# Altium schematic sheet TPA_LR.SchDoc
size A4; SheetNumber: 4; SheetTotal: 8
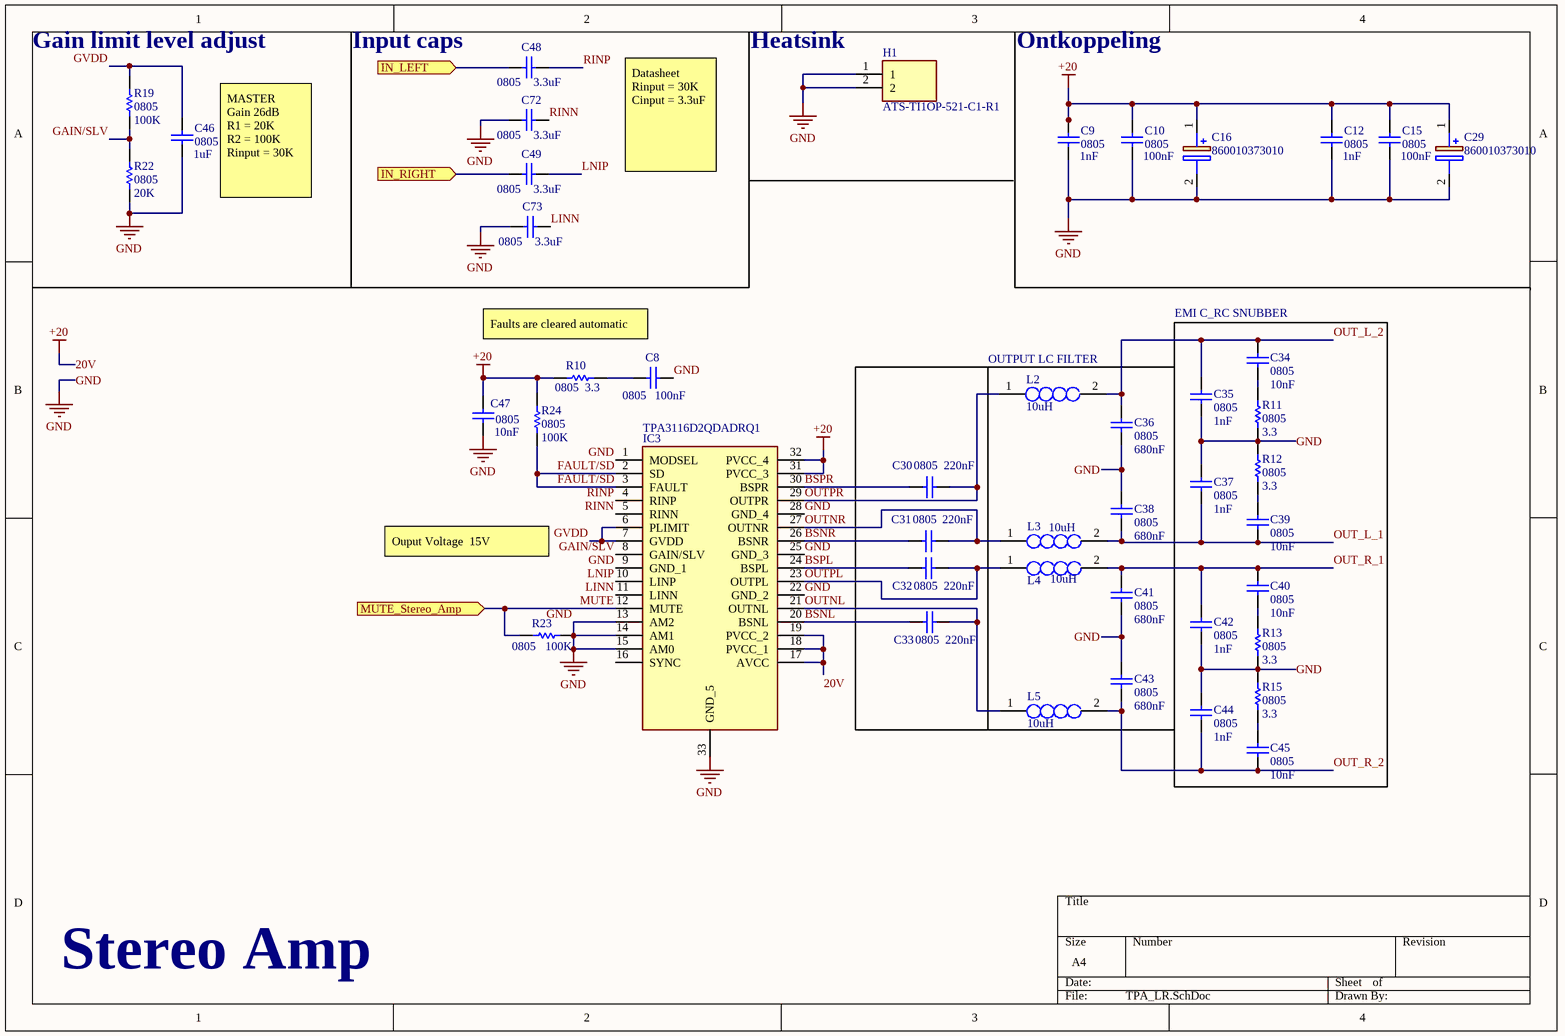
[diagram p0: TPA_LR.SchDoc]

## Parts
C8  0805  value 100nF  [6-0805_N]
C9  0805  value 1nF  [6-0805_N]
C10  0805  value 100nF  [6-0805_N]
C12  0805  value 1nF  [6-0805_N]
C15  0805  value 100nF  [6-0805_N]
C16  860010373010  [CAPPRD250W52D630H1250]
C29  860010373010  [CAPPRD250W52D630H1250]
C30  0805  value 220nF  [6-0805_N]
C31  0805  value 220nF  [6-0805_N]
C32  0805  value 220nF  [6-0805_N]
C33  0805  value 220nF  [6-0805_N]
C34  0805  value 10nF  [6-0805_N]
C35  0805  value 1nF  [6-0805_N]
C36  0805  value 680nF  [6-0805_N]
C37  0805  value 1nF  [6-0805_N]
C38  0805  value 680nF  [6-0805_N]
C39  0805  value 10nF  [6-0805_N]
C40  0805  value 10nF  [6-0805_N]
C41  0805  value 680nF  [6-0805_N]
C42  0805  value 1nF  [6-0805_N]
C43  0805  value 680nF  [6-0805_N]
C44  0805  value 1nF  [6-0805_N]
C45  0805  value 10nF  [6-0805_N]
C46  0805  value 1uF  [6-0805_N]
C47  0805  value 10nF  [6-0805_N]
C48  0805  value 3.3uF  [6-0805_N]
C49  0805  value 3.3uF  [6-0805_N]
C72  0805  value 3.3uF  [6-0805_N]
C73  0805  value 3.3uF  [6-0805_N]
H1  ATS-TI1OP-521-C1-R1  [ATSTI1OP521C1R1]
IC3  TPA3116D2QDADRQ1  [SOP65P810X120-33N]
L2  10uH  [INDPM110100X400N]
L3  10uH  [INDPM110100X400N]
L4  10uH  [INDPM110100X400N]
L5  10uH  [INDPM110100X400N]
R10  0805  value 3.3  [6-0805_N]
R11  0805  value 3.3  [6-0805_N]
R12  0805  value 3.3  [6-0805_N]
R13  0805  value 3.3  [6-0805_N]
R15  0805  value 3.3  [6-0805_N]
R19  0805  value 100K  [6-0805_N]
R22  0805  value 20K  [6-0805_N]
R23  0805  value 100K  [6-0805_N]
R24  0805  value 100K  [6-0805_N]

## Blocks framed on the sheet
EMI C_RC SNUBBER: C34 C35 C37 C39 C40 C42 C44 C45 R11-R13 R15
OUTPUT LC FILTER: C30-C33

## Ports
IN_LEFT (in, see Main[3A]), IN_RIGHT (in, see Main[3A]), MUTE_Stereo_Amp (in, see Main[3B], AnalogSwitch[3B])

## Nets
20V: C9.1 C10.1 C12.1 C15.1 C16.1(+) C29.1(+) C47.1 IC3.17(AVCC) IC3.18(PVCC_1) IC3.19(PVCC_2) IC3.31(PVCC_3) IC3.32(PVCC_4) R10.2 R24.2  [also labelled +20]
GND: C8.2 C9.2 C10.2 C12.2 C15.2 C16.2(-) C29.2(-) C35.1 C36.1 C37.2 C38.2 C41.1 C42.1 C43.2 C44.2 C46.2 C47.2 C72.1 C73.1 H1.1 H1.2 IC3.1(MODSEL) IC3.9(GND_1) IC3.13(AM2) IC3.14(AM1) IC3.15(AM0) IC3.22(GND_2) IC3.25(GND_3) IC3.28(GND_4) IC3.33(GND_5) R11.1 R12.2 R13.1 R15.2 R22.1 R23.1
BSNL: C33.1 IC3.20(BSNL)
BSNR: C31.1 IC3.26(BSNR)
BSPL: C32.1 IC3.24(BSPL)
BSPR: C30.1 IC3.30(BSPR)
FAULT/SD: IC3.2(SD) IC3.3(FAULT) R24.1
GAIN/SLV: IC3.8(GAIN/SLV) R19.1 R22.2
GVDD: C46.1 IC3.6(PLIMIT) IC3.7(GVDD) R19.2
IN_LEFT: C48.1 ; port IN_LEFT
IN_RIGHT: C49.1 ; port IN_RIGHT
LINN: C73.2 IC3.11(LINN)
LNIP: C49.2 IC3.10(LINP)
MUTE: IC3.12(MUTE) R23.2 ; port MUTE_Stereo_Amp
OUT_L_1: C37.1 C38.1 C39.1 L3.2
OUT_L_2: C34.2 C35.2 C36.2 L2.2
OUT_R_1: C40.2 C41.2 C42.2 L4.2
OUT_R_2: C43.1 C44.1 C45.1 L5.2
OUTNL: C33.2 IC3.21(OUTNL) L5.1
OUTNR: C31.2 IC3.27(OUTNR) L3.1
OUTPL: C32.2 IC3.23(OUTPL) L4.1
OUTPR: C30.2 IC3.29(OUTPR) L2.1
RINN: C72.2 IC3.5(RINN)
RINP: C48.2 IC3.4(RINP)
NetC8_1: C8.1 R10.1
NetC34_1: C34.1 R11.2
NetC39_2: C39.2 R12.1
NetC40_1: C40.1 R13.2
NetC45_2: C45.2 R15.1

Not connected (* = marked no-connect by the designer): IC3 16(SYNC)

## Notes on the sheet
- (near R19) Gain limit level adjust
- (near C48) Input caps
- (near H1) Heatsink
- Ontkoppeling
- Datasheet
  Rinput = 30K
  Cinput = 3.3uF
- (near C46) MASTER
  Gain 26dB
  R1 = 20K
  R2 = 100K
  Rinput = 30K
- Faults are cleared automatic
- Ouput Voltage  15V
- Stereo Amp

## Library data of the parts
C8-C10 C12 C15 C30-C49 C72 C73 = Cap: Capacitor; Published: 8-Jun-2000; LatestRevisionDate: 17-Jul-2002; LatestRevisionNote: Re-released for DXP Platform.; PackageReference: RAD-0.3; Publisher: Altium Limited; PackageDescription: Radial Cap, Thru-Hole; 2 Leads; 0.3 in Pin Spacing
C16 C29 = 860010373010: Capacitor Polarised; Manufacturer_Name: Wurth Elektronik; Datasheet Link: https://ms.componentsearchengine.com/Datasheets/2/860010373010.pdf; Height: 12.5mm; Manufacturer_Part_Number: 860010373010; Mouser Part Number: 710-860010373010; Mouser Price/Stock: https://www.mouser.com/Search/Refine.aspx?Keyword=710-860010373010
H1 = ATS-TI1OP-521-C1-R1: Hardware; Manufacturer_Name: ADVANCED THERMAL SOLUTIONS; Datasheet Link: https://media.digikey.com/pdf/Data%20Sheets/Advanced%20Thermal%20Solutions%20PDFs/ATS-TI10P-521-C1-R1.pdf; Height: 28mm; Manufacturer_Part_Number: ATS-TI1OP-521-C1-R1; Mouser Part Number: 984-ATS-TI1OP521C1R1; Mouser Price/Stock: https://www.mouser.co.uk/ProductDetail/Advanced-Thermal-Solutions/ATS-TI1OP-521-C1-R1?qs=MLItCLRbWsx43HjcCreTeQ%3D%3D; Arrow Part Number: ATS-TI1OP-521-C1-R1; Arrow Price/Stock: https://www.arrow.com/en/products/ats-ti1op-521-c1-r1/advanced-thermal-solutions?region=europe
IC3 = TPA3116D2QDADRQ1: Integrated Circuit; Manufacturer_Name: Texas Instruments; Datasheet Link: http://www.ti.com/lit/gpn/tpa3116d2-q1; Height: 1.2mm; Manufacturer_Part_Number: TPA3116D2QDADRQ1; Mouser Part Number: 595-TPA3116D2QDADRQ1; Mouser Price/Stock: https://www.mouser.co.uk/ProductDetail/Texas-Instruments/TPA3116D2QDADRQ1?qs=UPLqB4C8V4HphPtdRa3LzQ%3D%3D; Arrow Part Number: TPA3116D2QDADRQ1; Arrow Price/Stock: https://www.arrow.com/en/products/tpa3116d2qdadrq1/texas-instruments?region=nac
L2-L5 = SRP1038A-4R7M: Inductor; Manufacturer_Name: Bourns; Datasheet Link: http://uk.rs-online.com/web/p/products/8193346; Height: 4mm; Manufacturer_Part_Number: SRP1038A-4R7M; Mouser Part Number: 652-SRP1038A-4R7M; Mouser Price/Stock: https://www.mouser.co.uk/ProductDetail/Bourns/SRP1038A-4R7M/?qs=7z%252BmIopC6%2FImcvZmY6cLew%3D%3D; Arrow Part Number: SRP1038A-4R7M; Arrow Price/Stock: https://www.arrow.com/en/products/srp1038a-4r7m/bourns?region=nac
R10-R13 R15 R19 R22-R24 = Res1: Resistor; Published: 8-Jun-2000; LatestRevisionDate: 17-Jul-2002; LatestRevisionNote: Re-released for DXP Platform.; PackageReference: AXIAL-0.3; Publisher: Altium Limited; PackageDescription: Axial Device, Thru-Hole; 2 Leads; 0.3 in Pin Spacing